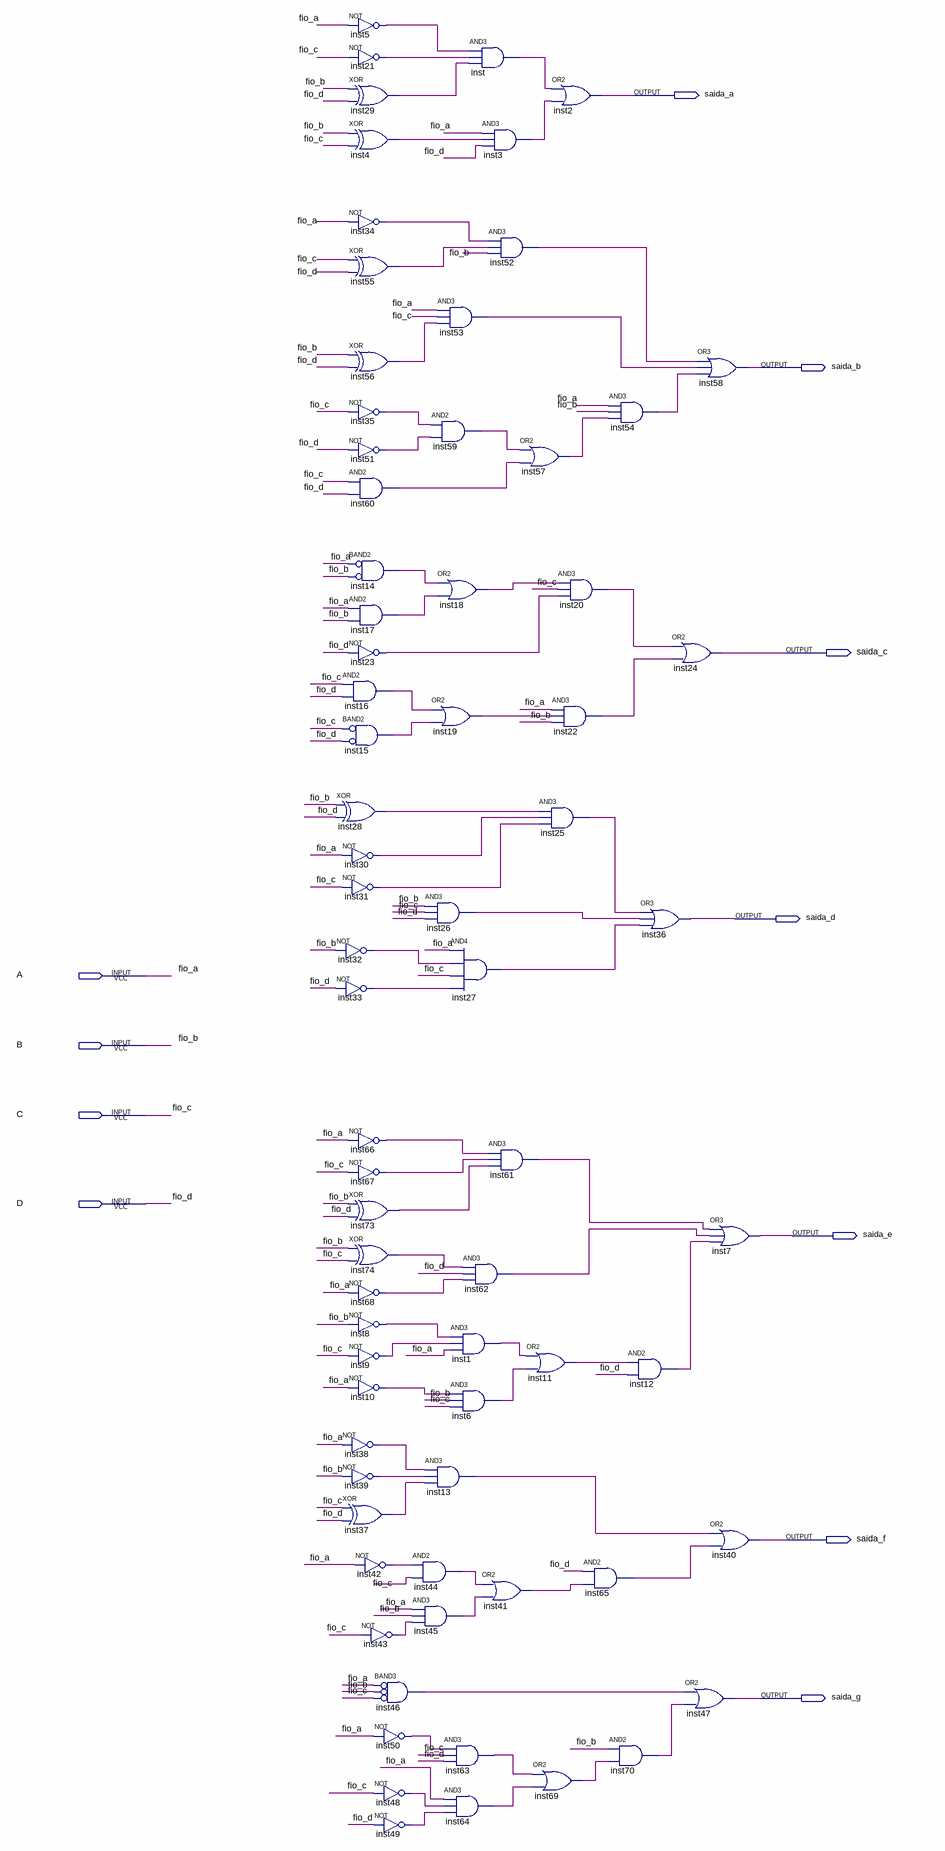
[diagram p0: schematic sheet]
// Quartus schematic aula4.bdf as structural Verilog: 73 symbols, 11 pins
module aula4 (
  input  A,
  input  B,
  input  C,
  input  D,
  output saida_a,
  output saida_b,
  output saida_c,
  output saida_d,
  output saida_e,
  output saida_f,
  output saida_g
);

  wire inst1_out, inst3_out, inst4_out, inst5_out, inst6_out, inst8_out, inst9_out, inst10_out, inst11_out,
       inst12_out, inst13_out, inst14_out, inst15_out, inst16_out, inst17_out, inst18_out, inst19_out,
       inst20_out, inst21_out, inst22_out, inst23_out, inst25_out, inst26_out, inst27_out, inst28_out,
       inst29_out, inst30_out, inst31_out, inst32_out, inst33_out, inst34_out, inst35_out, inst37_out,
       inst38_out, inst39_out, inst41_out, inst42_out, inst43_out, inst44_out, inst45_out, inst46_out,
       inst48_out, inst49_out, inst50_out, inst51_out, inst52_out, inst53_out, inst54_out, inst55_out,
       inst56_out, inst57_out, inst59_out, inst60_out, inst61_out, inst62_out, inst63_out, inst64_out,
       inst65_out, inst66_out, inst67_out, inst68_out, inst69_out, inst70_out, inst73_out, inst74_out,
       inst_out;

  not inst5 (inst5_out, A);
  not inst21 (inst21_out, C);
  xor inst29 (inst29_out, B, D);
  xor inst4 (inst4_out, B, C);
  not inst34 (inst34_out, A);
  xor inst55 (inst55_out, C, D);
  xor inst56 (inst56_out, B, D);
  not inst35 (inst35_out, C);
  not inst51 (inst51_out, D);
  and inst60 (inst60_out, C, D);
  and inst14 (inst14_out, ~A, ~B);  // BAND2
  and inst17 (inst17_out, A, B);
  not inst23 (inst23_out, D);
  and inst16 (inst16_out, C, D);
  and inst15 (inst15_out, ~C, ~D);  // BAND2
  xor inst28 (inst28_out, B, D);
  not inst30 (inst30_out, A);
  not inst31 (inst31_out, C);
  not inst32 (inst32_out, B);
  not inst33 (inst33_out, D);
  not inst66 (inst66_out, A);
  not inst67 (inst67_out, C);
  xor inst73 (inst73_out, B, D);
  xor inst74 (inst74_out, B, C);
  not inst68 (inst68_out, A);
  not inst8 (inst8_out, B);
  not inst9 (inst9_out, C);
  not inst10 (inst10_out, A);
  not inst38 (inst38_out, A);
  not inst39 (inst39_out, B);
  xor inst37 (inst37_out, C, D);
  not inst42 (inst42_out, A);
  not inst43 (inst43_out, C);
  and inst46 (inst46_out, ~A, ~B, ~C);  // BAND3
  not inst50 (inst50_out, A);
  not inst48 (inst48_out, C);
  not inst49 (inst49_out, D);
  and inst53 (inst53_out, A, C, inst56_out);
  and inst59 (inst59_out, inst35_out, inst51_out);
  or inst18 (inst18_out, inst14_out, inst17_out);
  or inst19 (inst19_out, inst16_out, inst15_out);
  and inst26 (inst26_out, B, C, D);
  and inst27 (inst27_out, A, inst32_out, C, inst33_out);
  and inst1 (inst1_out, inst8_out, inst9_out, A);
  and inst6 (inst6_out, inst10_out, B, C);
  and inst13 (inst13_out, inst38_out, inst39_out, inst37_out);
  and inst44 (inst44_out, inst42_out, C);
  and inst45 (inst45_out, A, B, inst43_out);
  and inst63 (inst63_out, inst50_out, C, D);
  and inst64 (inst64_out, A, inst48_out, inst49_out);
  and inst (inst_out, inst5_out, inst21_out, inst29_out);
  and inst3 (inst3_out, A, inst4_out, D);
  and inst52 (inst52_out, inst34_out, inst55_out, B);
  and inst61 (inst61_out, inst66_out, inst67_out, inst73_out);
  and inst62 (inst62_out, inst74_out, D, inst68_out);
  or inst41 (inst41_out, inst44_out, inst45_out);
  or inst2 (saida_a, inst_out, inst3_out);
  or inst57 (inst57_out, inst59_out, inst60_out);
  and inst22 (inst22_out, A, inst19_out, B);
  and inst25 (inst25_out, inst28_out, inst30_out, inst31_out);
  or inst11 (inst11_out, inst1_out, inst6_out);
  or inst69 (inst69_out, inst63_out, inst64_out);
  and inst20 (inst20_out, inst18_out, C, inst23_out);
  and inst65 (inst65_out, D, inst41_out);
  and inst54 (inst54_out, A, B, inst57_out);
  or inst36 (saida_d, inst25_out, inst26_out, inst27_out);
  and inst12 (inst12_out, inst11_out, D);
  and inst70 (inst70_out, B, inst69_out);
  or inst58 (saida_b, inst52_out, inst53_out, inst54_out);
  or inst24 (saida_c, inst20_out, inst22_out);
  or inst47 (saida_g, inst46_out, inst70_out);
  or inst7 (saida_e, inst61_out, inst62_out, inst12_out);
  or inst40 (saida_f, inst13_out, inst65_out);

  // Other names for the same wires on the sheet: fio_a = A; fio_b = B; fio_c = C; fio_d = D
endmodule
